# EAGLE design Audio (EAGLE 9.7.0)

## Sheet 1 of 2: ESP32
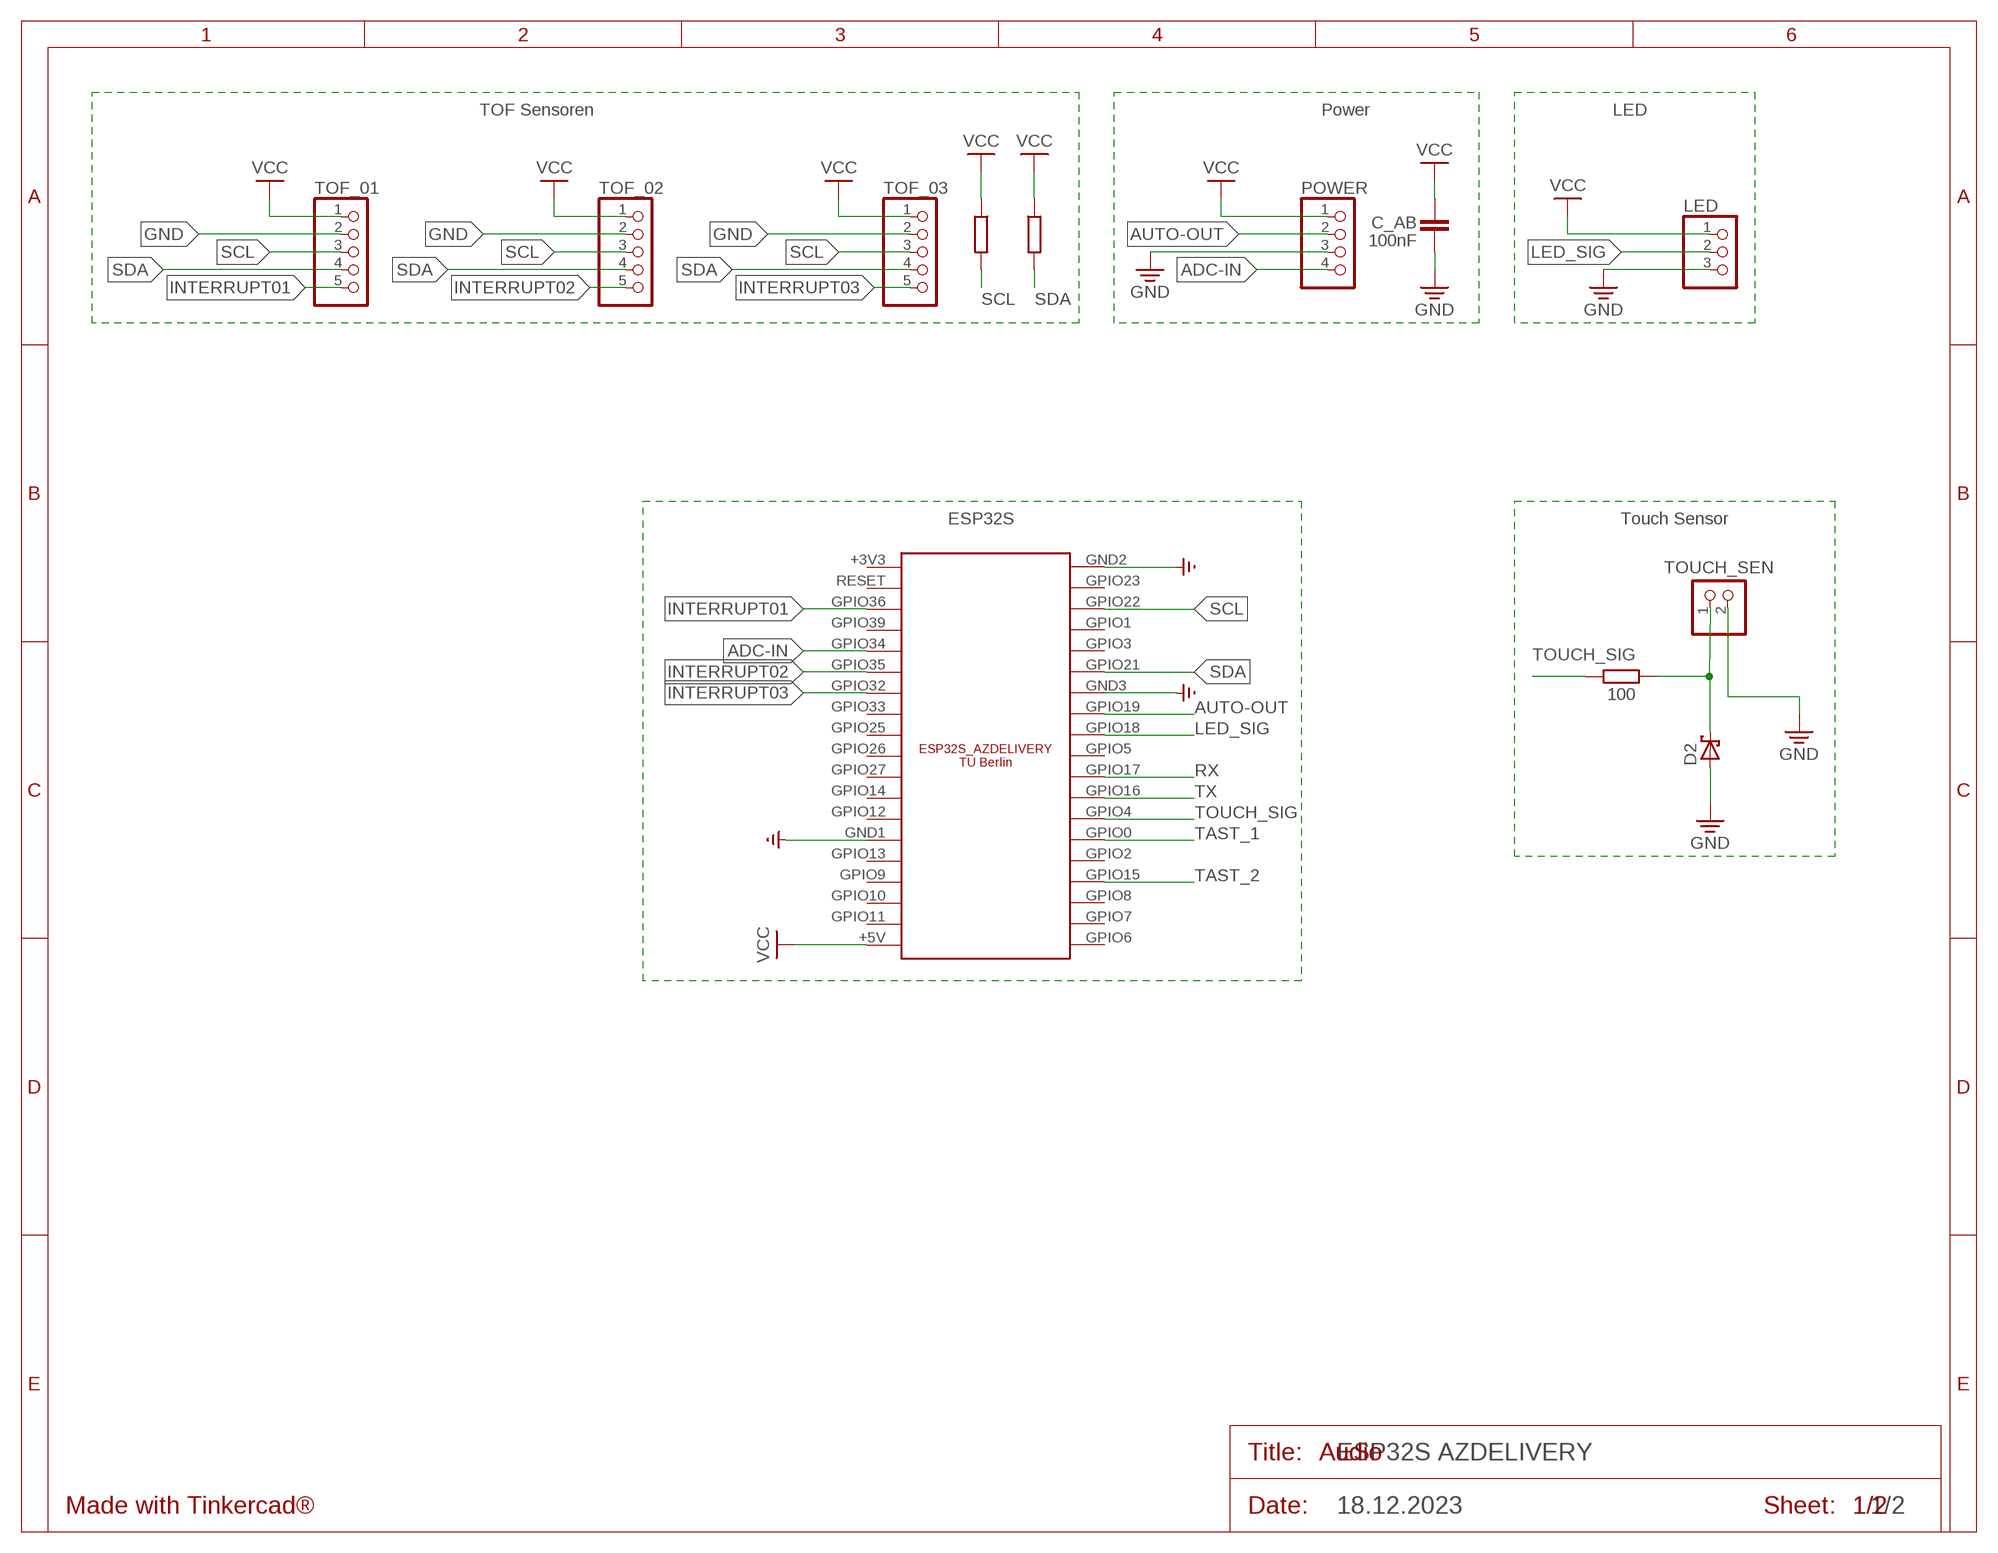
[diagram p0: schematic, sheet 1]

### Parts
C_AB  100nF  C-EUC1206K  [C1206K]
D2  1PS79SB30  [SOD523]
LED  PINHD-1X3/90  [1X03/90]
POWER  PINHD-1X4/90  [1X04/90]
R_FIL_6  100  R-EU_R1206  [R1206]
R_FIL_7  100  R-EU_R1206  [R1206]
R_TOUCH  100  R-EU_R1206  [R1206]
TOF_01  PINHD-1X5/90  [1X05/90]
TOF_02  PINHD-1X5/90  [1X05/90]
TOF_03  PINHD-1X5/90  [1X05/90]
TOUCH_SEN  PINHD-1X2/90  [1X02/90]
U$1  ESP32S_AZDELIVERY  [ESP32S_AZDELIVERY]

### Nets
ADC-IN: POWER.4 U$1.GPIO34
AUTO-OUT: POWER.2 U$1.GPIO19
GND: C_AB.1 D2.2(A) LED.3 POWER.3 TOF_01.2 TOF_02.2 TOF_03.2 TOUCH_SEN.2 U$1.GND1 U$1.GND2 U$1.GND3 ; supply symbol labelled SUPPLY0_GND_ ; also sheet 2
INTERRUPT01: TOF_01.5 U$1.GPIO36
INTERRUPT02: TOF_02.5 U$1.GPIO35
INTERRUPT03: TOF_03.5 U$1.GPIO32
LED_SIG: LED.2 U$1.GPIO18
N$10: D2.1(K) R_TOUCH.1 TOUCH_SEN.1
RX: U$1.GPIO17 ; also sheet 2
SCL: R_FIL_6.2 TOF_01.3 TOF_02.3 TOF_03.3 U$1.GPIO22
SDA: R_FIL_7.2 TOF_01.4 TOF_02.4 TOF_03.4 U$1.GPIO21
TAST_1: U$1.GPIO0 ; also sheet 2
TAST_2: U$1.GPIO15 ; also sheet 2
TOUCH_SIG: R_TOUCH.2 U$1.GPIO4
TX: U$1.GPIO16 ; also sheet 2
VCC: C_AB.2 LED.1 POWER.1 R_FIL_6.1 R_FIL_7.1 TOF_01.1 TOF_02.1 TOF_03.1 U$1.+5V ; also sheet 2
Unconnected: U$1.+3V3 U$1.GPIO1 U$1.GPIO2 U$1.GPIO3 U$1.GPIO5 U$1.GPIO6 U$1.GPIO7 U$1.GPIO8 U$1.GPIO9 U$1.GPIO10 U$1.GPIO11 U$1.GPIO12 U$1.GPIO13 U$1.GPIO14 U$1.GPIO23 U$1.GPIO25 U$1.GPIO26 U$1.GPIO27 U$1.GPIO33 U$1.GPIO39 U$1.RESET

### Notes on the sheet
- TOF Sensoren | Power | LED
- ESP32S | Touch Sensor
- ESP32S AZDELIVERY
- 18.12.2023 | 1/2

## Sheet 2 of 2: Audio Gruppe
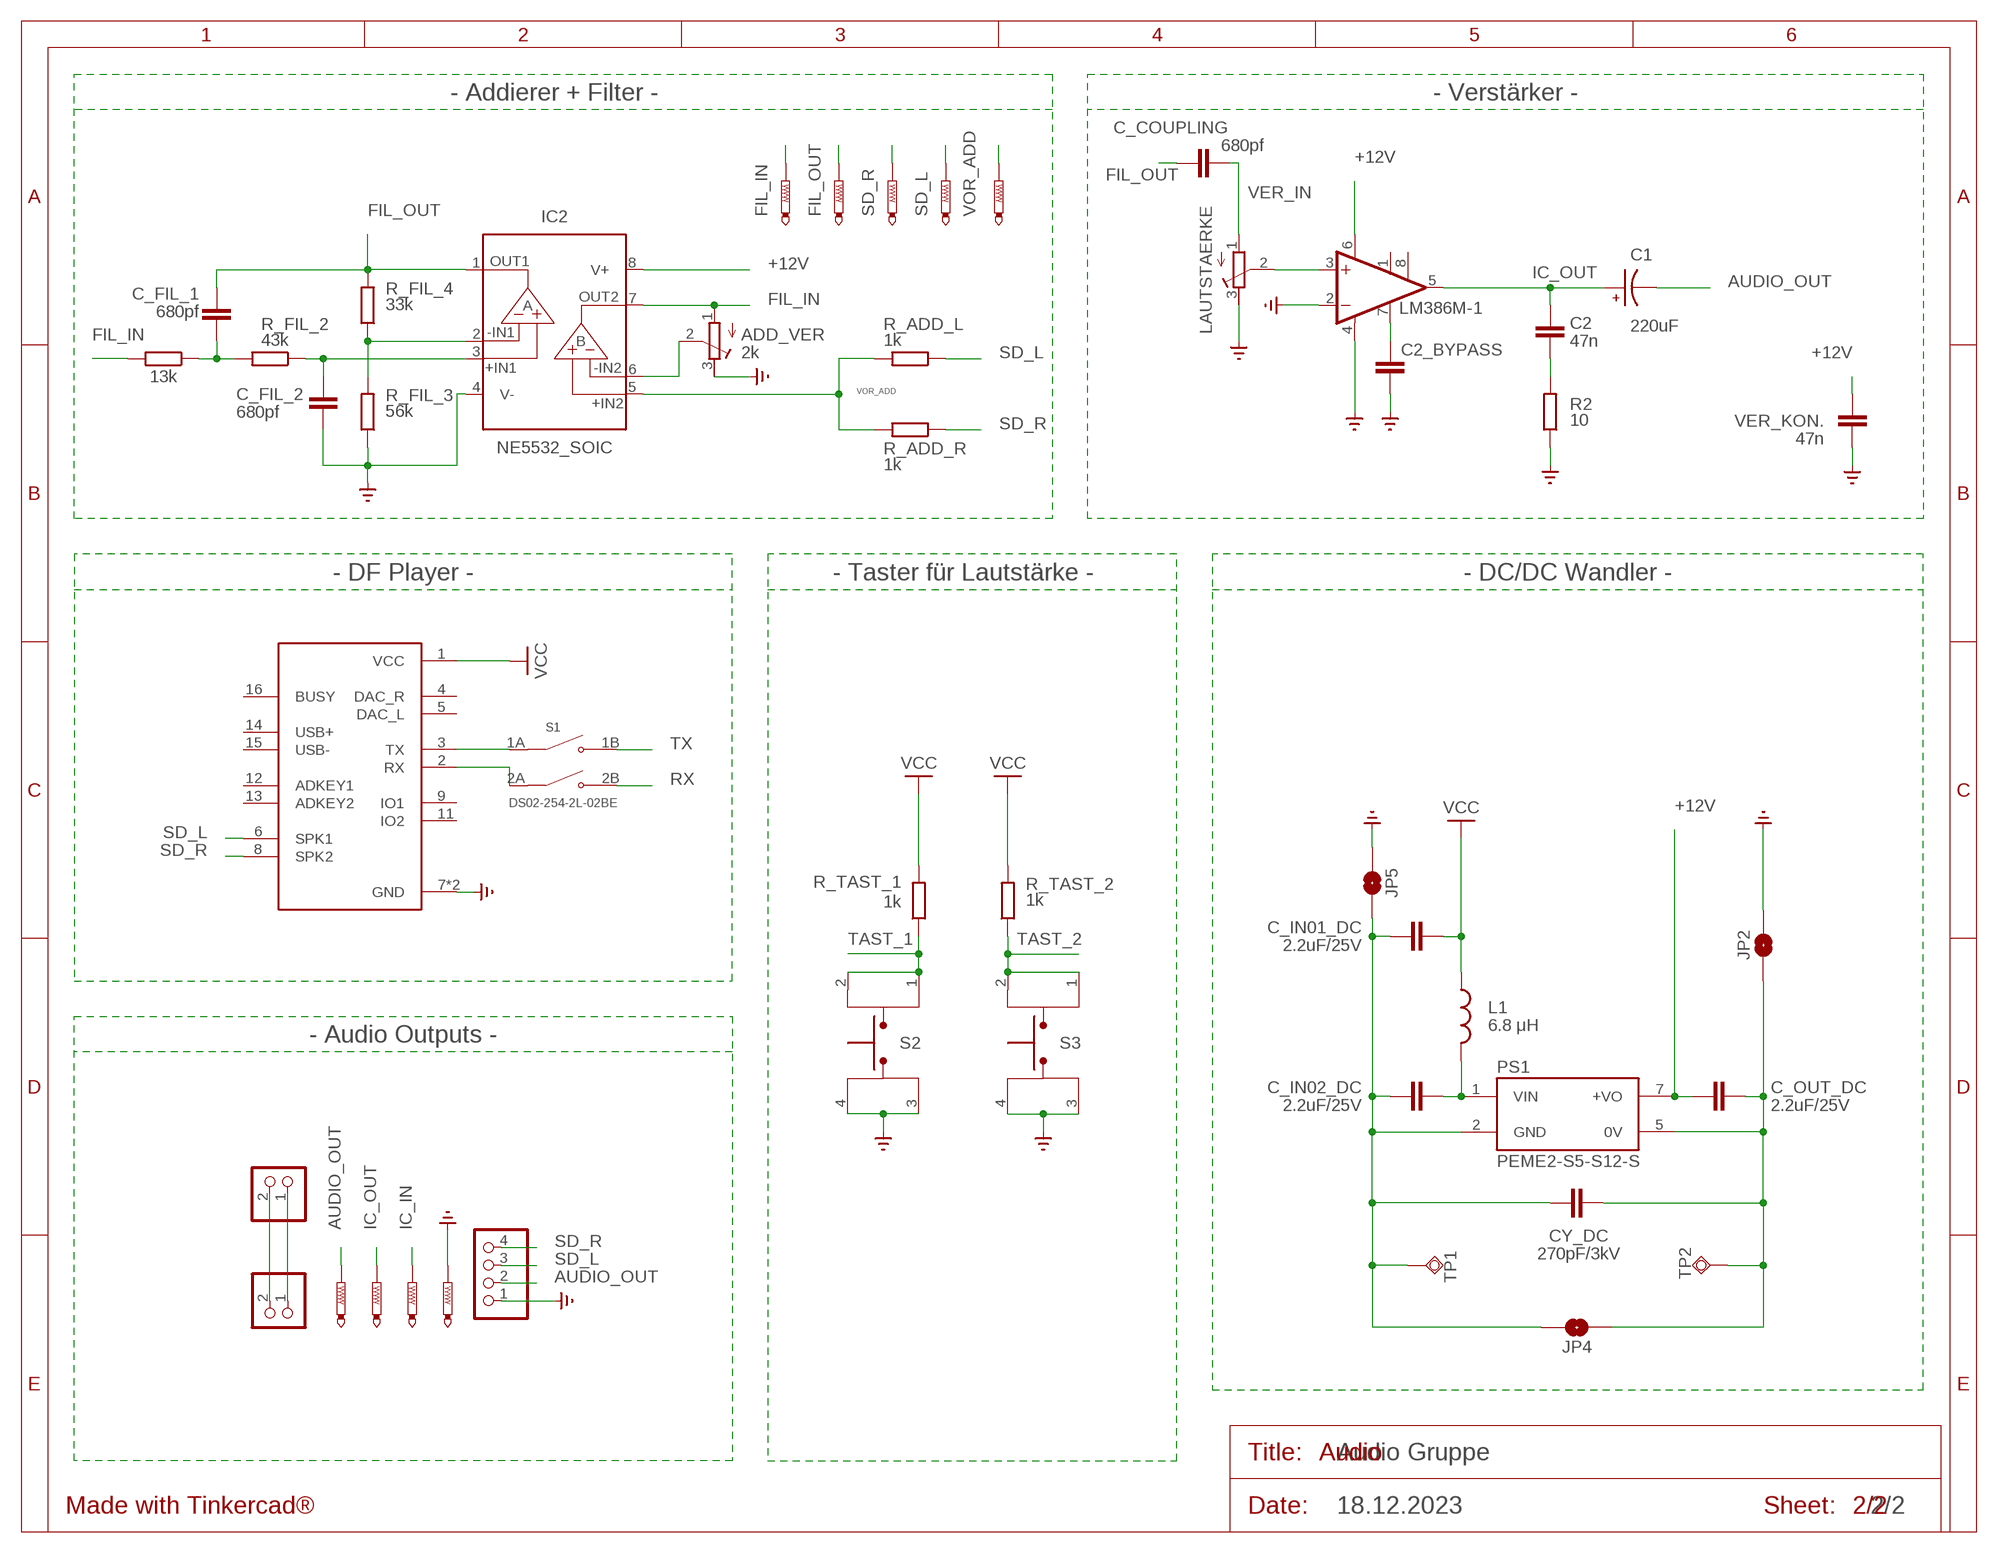
[diagram p1: schematic, sheet 2]

### Parts
ADD_OUT->FIL_IN  PTR1TP10R  [TP10R]
ADD_VER  2k  R-TRIMM4G/J  [RTRIM4G/J]
AUDIO_OUT1  PTR1TP10R  [TP10R]
C1  220uF  EEEFTE221XAP  [CAP_EEEFTE221XAP]
C2  47n  C-EUC1206K  [C1206K]
C2_BYPASS  C-EUC1206K  [C1206K]
C_COUPLING  680pf  C-EUC1206K  [C1206K]
C_FIL_1  680pf  C-EUC1206K  [C1206K]
C_FIL_2  680pf  C-EUC1206K  [C1206K]
C_IN01_DC  2.2uF/25V  C-EUC1206K  [C1206K]
C_IN02_DC  2.2uF/25V  C-EUC1206K  [C1206K]
C_OUT_DC  2.2uF/25V  C-EUC1206K  [C1206K]
CY_DC  270pF/3kV  C-EUC1206K  [C1206K]
FIL_OUT->AUDIO_IN  PTR1TP10R  [TP10R]
GND  PTR1TP10R  [TP10R]
IC1  LM386M-1  [SO08]
IC2  NE5532_SOIC  [SOIC127P600X175-8N]
IC_IN  PTR1TP10R  [TP10R]
IC_OUT  PTR1TP10R  [TP10R]
JP1  PINHD-1X2  [1X02]
JP2  JUMPER-SMT_2_NO_SILK  [SMT-JUMPER_2_NO_SILK]
JP3  PINHD-1X4  [1X04]
JP4  JUMPER-SMT_2_NO_SILK  [SMT-JUMPER_2_NO_SILK]
JP5  JUMPER-SMT_2_NO_SILK  [SMT-JUMPER_2_NO_SILK]
JP6  PINHD-1X2  [1X02]
L1  6.8 μH  L_CHIP-1206(3216-METRIC)  [INDC3216X190]
LAUTSTAERKE  R-TRIMM4G/J  [RTRIM4G/J]
PS1  PEME2-S5-S12-S  [CONV_PEME2-S5-S12-S]
R2  10  R-EU_R1206  [R1206]
R_ADD_L  1k  R-EU_R1206  [R1206]
R_ADD_R  1k  R-EU_R1206  [R1206]
R_FIL_1  13k  R-EU_R1206  [R1206]
R_FIL_2  43k  R-EU_R1206  [R1206]
R_FIL_3  56k  R-EU_R1206  [R1206]
R_FIL_4  33k  R-EU_R1206  [R1206]
R_TAST_1  1k  R-EU_R1206  [R1206]
R_TAST_2  1k  R-EU_R1206  [R1206]
S1  DS02-254-2L-02BE  [SW_DS02-254-2L-02BE]
S2  TL3305AF160QG  [SW_TL3305AF160QG]
S3  TL3305AF160QG  [SW_TL3305AF160QG]
SD_L  PTR1TP10R  [TP10R]
SD_R  PTR1TP10R  [TP10R]
TP1  TPSQPAD1-20Y  [P1-20Y]
TP2  TPSQPAD1-20Y  [P1-20Y]
U1  DFR0299  [MODULE_DFR0299]
VER_KON.  47n  C-EUC1206K  [C1206K]
VOR_ADD  PTR1TP10R  [TP10R]

### Nets
+12V: C_OUT_DC.1 IC1.6(VS) IC2.8(V+) PS1.7(+VO) VER_KON..2
AUDIO_OUT: AUDIO_OUT1.TP C1.2 JP3.2
FIL_IN: ADD_OUT->FIL_IN.TP ADD_VER.1(A) IC2.7(OUT2) R_FIL_1.2
FIL_OUT: C_COUPLING.2 C_FIL_1.2 FIL_OUT->AUDIO_IN.TP IC2.1(OUT1) R_FIL_4.2
GND: ADD_VER.3(E) C2_BYPASS.1 C_FIL_2.1 GND.TP IC1.2(-IN) IC1.4(GND) IC2.4(V-) JP2.2 JP3.1 JP5.1 LAUTSTAERKE.3(E) R2.1 R_FIL_3.1 S2.3 S2.4 S3.3 S3.4 U1.7(GND) U1.10(GND) VER_KON..1 ; supply symbol labelled SUPPLY0_GND_ ; also sheet 1
IC_IN: IC1.3(+IN) IC_IN.TP LAUTSTAERKE.2(S)
IC_OUT: C1.1 C2.2 IC1.5(OUT) IC_OUT.TP
N$1: IC2.2(-IN1) R_FIL_3.2 R_FIL_4.1
N$2: C2_BYPASS.2 IC1.7(BYPASS)
N$3: C2.1 R2.2
N$4: C_FIL_1.1 R_FIL_1.1 R_FIL_2.2
N$5: C_FIL_2.2 IC2.3(+IN1) R_FIL_2.1
N$6: S1.1A(COM1) U1.3(TX)
N$7: S1.2A(COM2) U1.2(RX)
N$8: JP1.2 JP6.2
N$9: JP1.1 JP6.1
N$13: ADD_VER.2(S) IC2.6(-IN2)
N$22: C_IN02_DC.2 L1.2 PS1.1(VIN)
N$29: C_OUT_DC.2 CY_DC.2 JP2.1 JP4.1 PS1.5(0V) TP2.TP
N$30: C_IN01_DC.1 C_IN02_DC.1 CY_DC.1 JP4.2 JP5.2 PS1.2(GND) TP1.TP
RX: S1.2B(NO2) ; also sheet 1
SD_L: JP3.3 R_ADD_L.1 SD_L.TP U1.6(SPK1)
SD_R: JP3.4 R_ADD_R.1 SD_R.TP U1.8(SPK2)
TAST_1: R_TAST_1.1 S2.1 S2.2 ; also sheet 1
TAST_2: R_TAST_2.1 S3.1 S3.2 ; also sheet 1
TX: S1.1B(NO1) ; also sheet 1
VCC: C_IN01_DC.2 L1.1 R_TAST_1.2 R_TAST_2.2 U1.1(VCC) ; also sheet 1
VER_IN: C_COUPLING.1 LAUTSTAERKE.1(A)
VOR_ADD: IC2.5(+IN2) R_ADD_L.2 R_ADD_R.2 VOR_ADD.TP
Unconnected: IC1.1(GAIN) IC1.8(GAIN) U1.4(DAC_R) U1.5(DAC_L) U1.9(IO1) U1.11(IO2) U1.12(ADKEY1) U1.13(ADKEY2) U1.14(USB+) U1.15(USB-) U1.16(BUSY)

### Notes on the sheet
- - Addierer + Filter - | - Verstärker -
- - DF Player - | - Taster für Lautstärke - | - DC/DC Wandler -
- - Audio Outputs -
- Audio Gruppe
- 18.12.2023 | 2/2

## Library data of the parts
ADD_OUT->FIL_IN AUDIO_OUT1 FIL_OUT->AUDIO_IN GND IC_IN IC_OUT SD_L SD_R VOR_ADD = testpad:PTR1: TEST PIN
ADD_VER LAUTSTAERKE = rcl:R-TRIMM: Trimm resistor; SPICEMODEL: X; SPICEPREFIXL: POT
C1 = EEEFTE221XAP:EEEFTE221XAP: Check availability <https://pricing.snapeda.com/parts/EEEFTE221XAP/Panasonic/view-part?ref=eda>; AVAILABILITY: In Stock; CHECK_PRICES: https://www.snapeda.com/parts/EEEFTE221XAP/Panasonic/view-part/?ref=eda; DESCRIPTION: 220µF 25V Aluminum Electrolytic Capacitors Radial, Can - SMD 160 mohm @ 100kHz 2000 Hrs @ 105°C; MF: Panasonic; MP: EEEFTE221XAP; PACKAGE: RADIAL-2 Panasonic; PRICE: None; PURCHASE-URL: https://www.snapeda.com/api/url_track_click_mouser/?unipart_id=4221972&manufacturer=Panasonic&part_name=EEEFTE221XAP&search_term=None; SNAPEDA_LINK: https://www.snapeda.com/parts/EEEFTE221XAP/Panasonic/view-part/?ref=snap
C2 C2_BYPASS C_AB C_COUPLING C_FIL_1 C_FIL_2 C_IN01_DC C_IN02_DC C_OUT_DC CY_DC VER_KON. = rcl:C-EU: CAPACITOR, European symbol; SPICEPREFIX: C
D2 = 1PS79SB30:1PS79SB30: Schottky barrier diode Planar Schottky barrier diode encapsulated in a SC-79 ultra small plastic SMD package. AAL Eindhoven MK Check availability <https://pricing.snapeda.com/parts/1PS79SB30/Nexperia%20USA/view-part?ref=eda>; AVAILABILITY: In Stock; CHECK_PRICES: https://www.snapeda.com/parts/1PS79SB30/Nexperia/view-part/?ref=eda; DESCRIPTION: Diode Schottky 40 V 200mA (DC) Surface Mount SOD-523; MF: Nexperia USA; MP: 1PS79SB30; PACKAGE: SOD-523 NXP Semiconductors; PRICE: None; SNAPEDA_LINK: https://www.snapeda.com/parts/1PS79SB30/Nexperia/view-part/?ref=snap
IC1 = linear:LM386?-*: Low Voltage Audio Power Amplifier Source: http://cache.national.com/ds/LM/LM386.pdf
IC2 = IC_Linear:NE5532: Dual Operational Amplifier Reference Datasheet <https://www.ti.com/lit/ds/symlink/ne5532.pdf?ts=1645701697800&ref_url=https%253A%252F%252Fwww.google.com%252F>; CATEGORY: Amplifier; DESCRIPTION: Dual Operational Amplifier; MANUFACTURER: Generic; MPN: Generic; SERIES: NE5532; SUB-CATEGORY: OpAmp; TYPE: Dual
JP1 JP6 = Connector:PINHD-1X2: PIN HEADER; CATEGORY: CONNECTOR; SUB-CATEGORY: PIN-HEADER
JP2 JP4 JP5 = SparkFun-Jumpers:JUMPER-SMT_2_NO: Normally open jumper This jumper has two pads in close proximity to each other. Apply solder to close the connection. Round pads are easier to solder for beginners, but are a lot larger. SparkFun Product that uses the round pads: SparkFun EL Sequencer <https://www.sparkfun.com/products/12781>
JP3 = Connector:PINHD-1X4: PIN HEADER; CATEGORY: CONNECTOR; SUB-CATEGORY: PIN-HEADER
L1 = Inductor:L: Inductor Fixed - Generic; CATEGORY: Inductor; SUB-CATEGORY: Fixed
LED = Connector:PINHD-1X3: PIN HEADER; CATEGORY: Headers; DESCRIPTION: Header, Right Angle, 3 Position; MANUFACTURER: Generic; MPN: Generic; OPERATING_TEMPERATURE: Generic; PART_STATUS: Active; PITCH: 0.100" (2.54mm); ROHS_COMPLIANCE: Generic; SERIES: Generic; SUB-CATEGORY: Headers, Male Pins; TYPE: Board to Board or Cable, Unshrouded, Through Hole, Right Angle
POWER = Connector:PINHD-1X4: PIN HEADER; CATEGORY: Headers; DESCRIPTION: Header, Right Angle, 4 Position; MANUFACTURER: Generic; MPN: Generic; OPERATING_TEMPERATURE: Generic; PART_STATUS: Active; PITCH: 0.100" (2.54mm); ROHS_COMPLIANCE: Generic; SERIES: Generic; SUB-CATEGORY: Headers, Male Pins; TYPE: Board to Board or Cable, Unshrouded, Through Hole, Right Angle
PS1 = PEME2-S5-S12-S:PEME2-S5-S12-S: Check availability <https://pricing.snapeda.com/parts/PEME2-S5-S12-S/CUI/view-part?ref=eda> Check availability <https://pricing.snapeda.com/parts/PEME2-S5-S12-S/CUI/view-part?ref=eda> Check availability <https://pricing.snapeda.com/parts/PEME2-S5-S12-S/CUI%20Inc./view-part?ref=eda>; AVAILABILITY: In Stock; CHECK_PRICES: https://www.snapeda.com/parts/PEME2-S5-S12-S/CUI/view-part/?ref=eda; CUI_PURCHASE_URL: https://www.cui.com/product/dc-dc-converters/isolated/peme2-s-series?utm_source=snapeda.com&utm_medium=referral&utm_campaign=snapedaBOM; DESCRIPTION: 2 W, 1:1 Input Range, Single/Dual Unregulated Output, SIP, 3000 Vdc Isolation, Dc-Dc Converter; MF: CUI Inc.; MP: PEME2-S5-S12-S; PACKAGE: None; PRICE: None; PURCHASE-URL: https://www.snapeda.com/api/url_track_click_mouser/?unipart_id=11882107&manufacturer=CUI Inc.&part_name=PEME2-S5-S12-S&search_term=peme2-s5-s12-s; SNAPEDA_LINK: https://www.snapeda.com/parts/PEME2-S5-S12-S/CUI/view-part/?ref=snap
R2 R_ADD_L R_ADD_R R_FIL_1-R_FIL_4 R_FIL_6 R_FIL_7 R_TAST_1 R_TAST_2 R_TOUCH = rcl:R-EU_: RESISTOR, European symbol; SPICEPREFIX: R
S1 = DS02:DS02-254-2L-02BE: Check availability <https://pricing.snapeda.com/parts/DS02-254-2L-02BE/CUI%20Devices/view-part?ref=eda>; AVAILABILITY: In Stock; CHECK_PRICES: https://www.snapeda.com/parts/DS02-254-2L-02BE/CUI+Devices/view-part/?ref=eda; CUI_PURCHASE_URL: https://www.cuidevices.com/product/switches/dip-switches/ds02-254-2l-02be?utm_source=snapeda.com&utm_medium=referral&utm_campaign=snapedaBOM; DESCRIPTION: 2 Position, Through Hole, 2.54 mm Pitch, Flat Piano Slide Actuator, Flat Bottom, Long Pin, DIP Switch; MF: CUI Devices; MP: DS02-254-2L-02BE; PACKAGE: None; PRICE: None; PURCHASE-URL: https://www.snapeda.com/api/url_track_click_mouser/?unipart_id=4467380&manufacturer=CUI Devices&part_name=DS02-254-2L-02BE&search_term=nt 02 dip switch; SNAPEDA_LINK: https://www.snapeda.com/parts/DS02-254-2L-02BE/CUI+Devices/view-part/?ref=snap
S2 S3 = TL3305AF160QG:TL3305AF160QG: Check availability <https://pricing.snapeda.com/parts/TL3305AF160QG/E-Switch/view-part?ref=eda>; AVAILABILITY: In Stock; CHECK_PRICES: https://www.snapeda.com/parts/TL3305AF160QG/E-Switch/view-part/?ref=eda; DESCRIPTION: Tactile Switch SPST-NO Top Actuated Surface Mount; MF: E-Switch; MP: TL3305AF160QG; PACKAGE: None; PRICE: None; PURCHASE-URL: https://www.snapeda.com/api/url_track_click_mouser/?unipart_id=560109&manufacturer=E-Switch&part_name=TL3305AF160QG&search_term=switch smd; SNAPEDA_LINK: https://www.snapeda.com/parts/TL3305AF160QG/E-Switch/view-part/?ref=snap
TOF_01-TOF_03 = Connector:PINHD-1X5: PIN HEADER; CATEGORY: Headers; DESCRIPTION: Header, Right Angle, 5 Position; MANUFACTURER: Generic; MPN: Generic; OPERATING_TEMPERATURE: Generic; PART_STATUS: Active; PITCH: 0.100" (2.54mm); ROHS_COMPLIANCE: Generic; SERIES: Generic; SUB-CATEGORY: Headers, Male Pins; TYPE: Board to Board or Cable, Unshrouded, Through Hole, Right Angle
TOUCH_SEN = Connector:PINHD-1X2: PIN HEADER; CATEGORY: Headers; DESCRIPTION: Header, Right Angle, 2 Position; MANUFACTURER: Generic; MPN: Generic; OPERATING_TEMPERATURE: Generic; PART_STATUS: Active; PITCH: 0.100" (2.54mm); ROHS_COMPLIANCE: Generic; SERIES: Generic; SUB-CATEGORY: Headers, Male Pins; TYPE: Board to Board or Cable, Unshrouded, Through Hole, Right Angle
TP1 TP2 = testpad:TPSQ: Test pad
U1 = DFR0299:DFR0299: Dfplayer - a Mini Mp3 Player Check availability <https://pricing.snapeda.com/parts/DFR0299/DFRobot/view-part?ref=eda>; AVAILABILITY: In Stock; CHECK_PRICES: https://www.snapeda.com/parts/DFR0299/DFRobot/view-part/?ref=eda; DESCRIPTION: - MP3 Player Audio Arduino Platform Evaluation Expansion Board; MF: DFRobot; MP: DFR0299; PACKAGE: None; PRICE: None; PURCHASE-URL: https://www.snapeda.com/api/url_track_click_mouser/?unipart_id=588059&manufacturer=DFRobot&part_name=DFR0299&search_term=None; SNAPEDA_LINK: https://www.snapeda.com/parts/DFR0299/DFRobot/view-part/?ref=snap
U$1 = ESP32S_AZDELIVERY:ESP32S_AZDELIVERY: ESP32S_AZDELIVERY erstellet von Ammar Al Dakkak

## Board
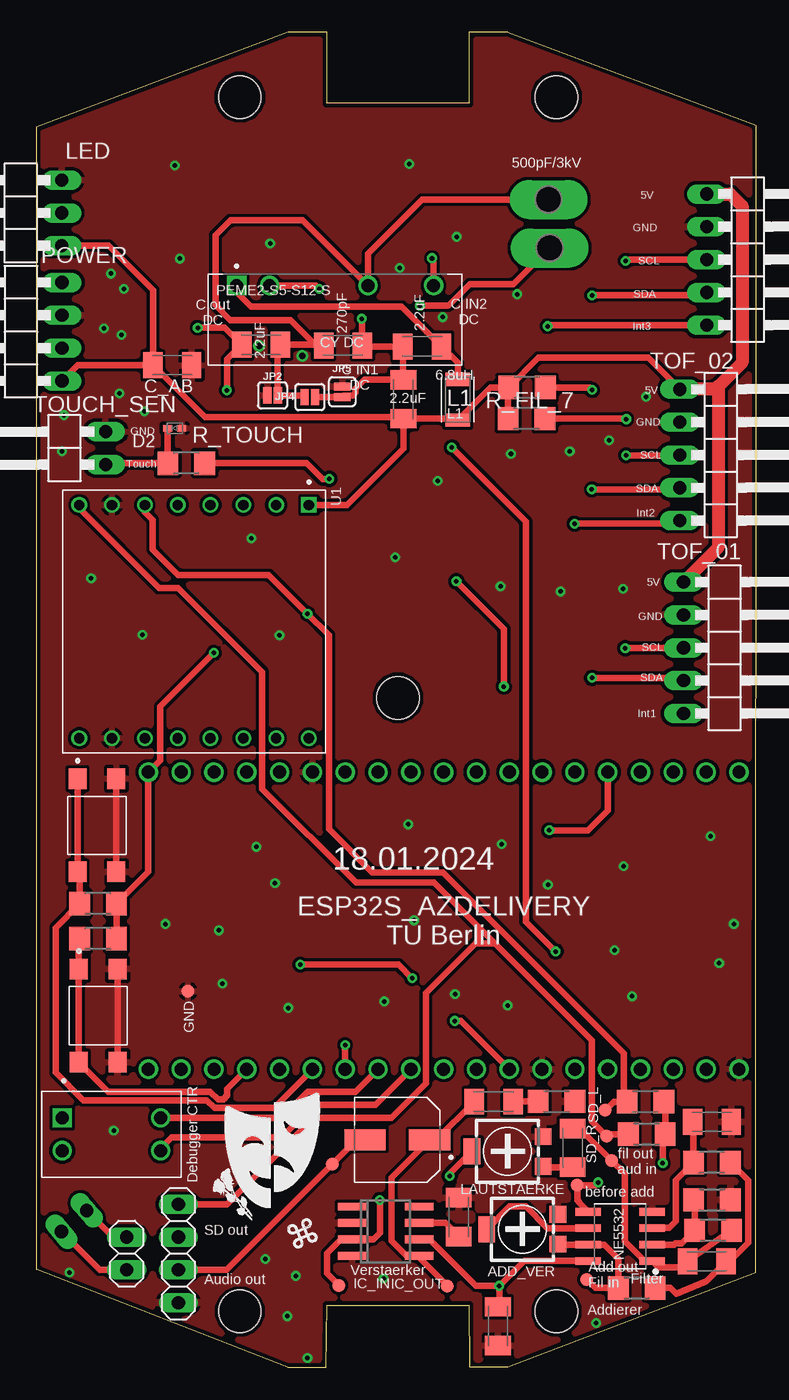
[diagram p2: board, top side]
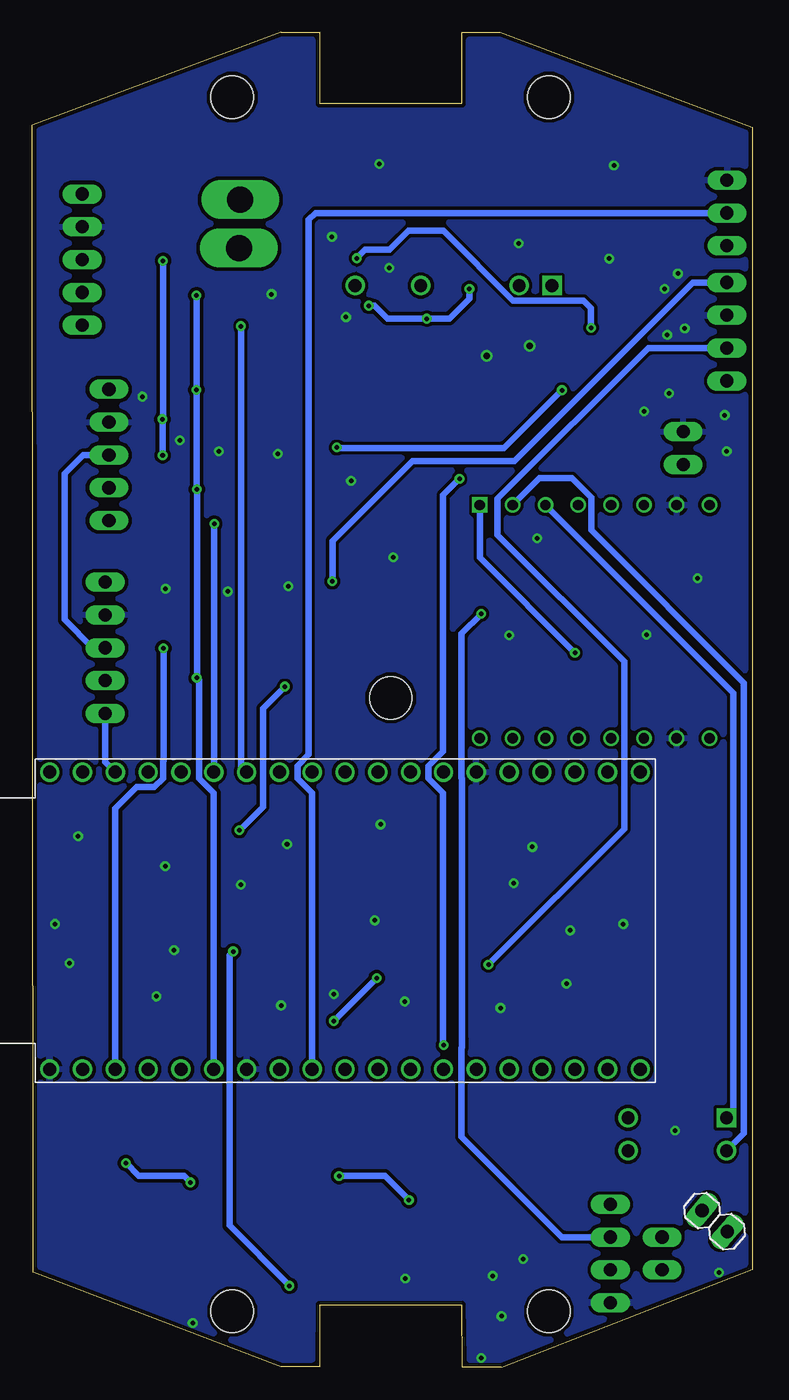
[diagram p3: board, bottom side, seen from below]

Size 55.75 x 103.3 mm. Coordinates in mm from the lower left corner, seen from the top.
Outline: 0,7.53 0,95.94 19.5,103.3 22.5,103.3 22.5,97.8 33.5,97.8 33.5,103.3 36.5,103.3 55.75,96.11 55.69,7.36 36.52,0.01 33.52,0.01 33.5,4.8 22.5,4.8 22.44,0 19.44,0 0,7.57
Copper layers (1*16): Top / Bottom
Stack-up Default Layer Stack: Top User Defined 0.035mm / Dielectric-1 User Defined 1.5mm / Bottom User Defined 0.035mm
Design rules: minimum copper width 0.2mm, minimum drill size 0.3mm, copper clearance wire_polygon to wire_polygon 0.15mm, copper clearance wire_polygon to pad_smd 0.15mm, copper clearance wire_polygon to via 0.15mm, copper clearance pad_smd to pad_smd 0.15mm, copper clearance pad_smd to via 0.15mm, copper clearance via to via 0.15mm, copper clearance smd to pad (same net) 0mil, copper clearance smd to via (same net) 0mil, copper clearance smd to smd (same net) 0mil, dimension clearance 0.3mm, restrict clearance 0mil, drill distance 0.3mm, keepout clearance 0mil
Holes 3.3 mm at 40.27,98.28 15.76,98.28 15.76,4.31 40.27,4.31 28,51.8

### Footprints (pad centres in the part's own frame; a part is rotated, then mirrored left to right if it is on the bottom)
TP10R = smd 1 x 1: TP 0,0
RTRIM4G/J = smd 1.3 x 1.3: 1 -1.15,-2.75; 3 1.15,-2.75 | smd 2 x 1.3: 2 0,2.75
CAP_EEEFTE221XAP = smd 3.2 x 1.6: 1 -2.5,0; 2 2.5,0
C1206K = smd 1.5 x 2: 1 -1.5,0; 2 1.5,0
SOD523 = smd 0.7 x 0.5: 1 0.55,0; 2 -0.55,0
SO08 = smd 0.6 x 2.2: 1 -1.905,-2.6; 2 -0.635,-2.6; 3 0.635,-2.6; 4 1.905,-2.6; 5 1.905,2.6; 6 0.635,2.6; 7 -0.635,2.6; 8 -1.905,2.6
SOIC127P600X175-8N = smd 1.969 x 0.592: 1 -2.474,1.905; 2 -2.474,0.635; 3 -2.474,-0.635; 4 -2.474,-1.905; 5 2.474,-1.905; 6 2.474,-0.635; 7 2.474,0.635; 8 2.474,1.905
1X02 = drill 1.016 long: 1 -1.27,0; 2 1.27,0
SMT-JUMPER_2_NO_SILK = smd 0.635 x 1.27: 1 -0.406,0; 2 0.406,0
1X04 = drill 1.016 long: 1 -3.81,0; 2 -1.27,0; 3 1.27,0; 4 3.81,0
INDC3216X190 = smd 1.043 x 1.91: 1 -1.584,0; 2 1.584,0
1X03/90 = drill 1.016 long: 1 -2.54,-3.81; 2 0,-3.81; 3 2.54,-3.81
1X04/90 = drill 1.016 long: 1 -3.81,-3.81; 2 -1.27,-3.81; 3 1.27,-3.81; 4 3.81,-3.81
CONV_PEME2-S5-S12-S = drill 1 square: 1 -7.615,2.625 | drill 1: 2 -5.075,2.625; 5 2.545,2.625; 7 7.625,2.625
R1206 = smd 1.6 x 1.803: 1 -1.422,0; 2 1.422,0
SW_DS02-254-2L-02BE = drill 1 square: 1A -1.27,-3.81 | drill 1: 1B -1.27,3.81; 2A 1.27,-3.81; 2B 1.27,3.81
SW_TL3305AF160QG = smd 1.6 x 1.4: 1 -3.6,-1.5; 2 3.6,-1.5; 3 -3.6,1.5; 4 3.6,1.5
1X05/90 = drill 1.016 long: 1 -5.08,-3.81; 2 -2.54,-3.81; 3 0,-3.81; 4 2.54,-3.81; 5 5.08,-3.81
1X02/90 = drill 1.016 long: 1 -1.27,-3.81; 2 1.27,-3.81
P1-20Y = drill 2.007 pad 2.54 long: TP 0,0
MODULE_DFR0299 = drill 0.8 square: 1 -9.017,8.89 | drill 0.8: 2 -9.017,6.35; 3 -9.017,3.81; 4 -9.017,1.27; 5 -9.017,-1.27; 6 -9.017,-3.81; 7 -9.017,-6.35; 8 -9.017,-8.89; 9 9.017,-8.89; 10 9.017,-6.35; 11 9.017,-3.81; 12 9.017,-1.27; 13 9.017,1.27; 14 9.017,3.81; 15 9.017,6.35; 16 9.017,8.89
ESP32S_AZDELIVERY = drill 1: +3V3 -11.5,22.86; +5V -11.5,-22.86; GND1 -11.5,-10.16; GND2 11.5,22.86; GND3 11.5,7.62; GPIO0 11.5,-10.16; GPIO1 11.5,15.24; GPIO2 11.5,-12.7; GPIO3 11.5,12.7; GPIO4 11.5,-7.62; GPIO5 11.5,0; GPIO6 11.5,-22.86; GPIO7 11.5,-20.32; GPIO8 11.5,-17.78; GPIO9 -11.5,-15.24; GPIO10 -11.5,-17.78; GPIO11 -11.5,-20.32; GPIO12 -11.5,-7.62; GPIO13 -11.5,-12.7; GPIO14 -11.5,-5.08; GPIO15 11.5,-15.24; GPIO16 11.5,-5.08; GPIO17 11.5,-2.54; GPIO18 11.5,2.54; GPIO19 11.5,5.08; GPIO21 11.5,10.16; GPIO22 11.5,17.78; GPIO23 11.5,20.32; GPIO25 -11.5,2.54; GPIO26 -11.5,0; GPIO27 -11.5,-2.54; GPIO32 -11.5,7.62; GPIO33 -11.5,5.08; GPIO34 -11.5,12.7; GPIO35 -11.5,10.16; GPIO36 -11.5,17.78; GPIO39 -11.5,15.24; RESET -11.5,20.32

### Placement (x,y rotation side)
ADD_OUT->FIL_IN  42.61,6.8 180 top
ADD_VER  37.62,10.68 90 top
AUDIO_OUT1  22.9,15.7 0 top
C1  27.95,17.59 180 top
C2  35.41,20.55 180 top
C2_BYPASS  32.71,11.61 270 top
C_AB  10.53,77.54 180 top
C_COUPLING  41.52,16.98 90 top
C_FIL_1  51.9,8.2 180 top
C_FIL_2  52.3,18.98 180 top
C_IN01_DC  28.42,74.9 270 top
C_IN02_DC  29.87,78.99 0 top
C_OUT_DC  17.4,79.13 0 top
CY_DC  23.74,79.07 180 top
D2  10.71,72.66 180 top
FIL_OUT->AUDIO_IN  44.55,15.98 0 top
GND  11.75,29.08 0 top
IC1  27.05,10.53 270 top
IC2  45.2,10.12 180 top
IC_IN  23.43,6.33 0 top
IC_OUT  31.82,6.3 0 top
JP1  7,8.8 90 top
JP2  18.29,75.19 180 top
JP3  11,8.8 90 top
JP4  21.18,75.07 0 top
JP5  23.68,75.48 270 top
JP6  2.93,11.31 140 bottom
L1  32.63,74.87 90 top
LAUTSTAERKE  36.49,16.7 90 top
LED  -1.83,89.32 90 top
POWER  -1.81,80.13 90 top
PS1  23.13,81.08 0 top
R2  40.27,20.57 180 top
R_ADD_L  47.16,20.55 0 top
R_ADD_R  47.26,18.03 0 top
R_FIL_1  46.48,6.14 180 top
R_FIL_2  52.3,15.84 0 top
R_FIL_3  52.3,12.95 180 top
R_FIL_4  52.39,10.59 0 top
R_FIL_6  37.95,73.41 0 top
R_FIL_7  37.99,75.82 0 top
R_TAST_1  4.79,35.87 0 top
R_TAST_2  4.79,33.16 0 top
R_TOUCH  11.61,69.95 0 top
S1  5.82,18.02 270 top
S2  4.7,41.93 270 top
S3  4.8,27.2 270 top
SD_L  44.05,19.88 0 top
SD_R  44.15,17.88 0 top
TOF_01  53.92,55.67 270 top
TOF_02  53.63,70.59 270 top
TOF_03  55.7,85.71 270 top
TOUCH_SEN  1.55,71.13 90 top
TP1  39.75,86.61 270 top
TP2  39.65,90.36 270 top
U1  12.22,57.7 270 top
U$1  31.54,34.55 270 top
VER_KON.  35.74,3.17 90 top
VOR_ADD  41.89,14.08 180 top

### Tracks (layer width: path | path; a pad name or v marks a point on that pad's centre or on a via)
+12V  (via drill 0.35)
  Top 0.508: v14.75,75.61 14.78,75.61 14.78,78 C_OUT_DC.1 14.59,80.44 v12.5,80.44 | v32.17,71.17 37.9,65.44 37.9,34.47 v40.2,32.17 | IC1.6 30.45,9.89 34.05,6.29 v35.84,6.29 | v35.84,6.29 35.84,4.78 VER_KON..2 | IC2.8 37.77,8.22 v35.84,6.29 | v30.63,85.82 30.76,85.69 PS1.7
  Bottom 0.508: v14.75,75.61 19.23,71.12 32.17,71.12 v32.17,71.17 | v40.2,32.17 40.49,31.88 40.49,10.97 v35.83,6.31 v35.84,6.29 | v35.84,6.29 | v30.63,85.82 29.98,86.47 28.11,86.47 26.64,87.93 23.92,87.93 18.54,82.55 13.1,82.55 12.5,81.95 v12.5,80.44
ADC-IN  (via drill 0.35)
  Top 0.508: v32.52,60.81 36.2,57.13 v36.2,52.67 | v39.72,41.54 42.72,41.54 44.24,43.06 U$1.GPIO34
  Bottom 0.508: POWER.4 4.63,83.94 18.44,70.13 26.34,70.13 32.52,63.95 v32.52,60.81 | v36.2,52.67 37.9,50.96 37.9,43.36 v39.72,41.54
AUDIO_OUT
  Top 0.5: AUDIO_OUT1.TP 14.73,7.53 JP3.2
  Top 0.508: C1.2 24.79,17.59 AUDIO_OUT1.TP
AUTO-OUT  (via drill 0.35)
  Top 0.508: v20.44,31.15 28.04,31.15 v29.09,30.1 | v32.4,26.79 32.88,26.79 U$1.GPIO19
  Bottom 0.508: POWER.2 8.08,78.86 19.74,67.21 19.74,64.4 9.92,54.59 9.92,41.67 v20.44,31.15 | v29.09,30.1 v32.4,26.79
FIL_IN
  Top 0.508: ADD_VER.1 40.42,9.49 IC2.7 43.97,9.49 45.06,8.41 R_FIL_1.2 43.28,6.14 ADD_OUT->FIL_IN.TP
FIL_OUT
  Top 0.508: R_FIL_4.2 C_FIL_1.2 49.95,7.75 48.15,7.75 IC2.1 47.08,8.22 45.55,9.75 45.55,14.98 FIL_OUT->AUDIO_IN.TP 42.05,18.48 C_COUPLING.2
GND  (via drill 0.35, 0.5)
  Top 0.508: S2.3 S2.4 | S3.3 S3.4
  other vias: 6,18.3 10,34.3 54,34.3 17.74,8.37 8.21,56.69 18.83,56.65 4.25,61.05 16.66,64.15 26.88,6.86 20.1,7.07 19.43,3.95 14.4,29.69 14.13,33.8 18.49,37.44 17.04,40.26 52.87,31.26 44.78,32.26 45.46,38.77 52.2,41.09 46.13,28.7 36.03,40.48 39.61,37.34 28.79,42 29.25,34.58 36.48,28 32.42,28.86 26.93,28.3 19.51,27.8 18.11,86.96 11.11,85.79 31.47,81.26 32.55,87.48 47.21,75.1 44.33,71.72 41.3,70.87 36.74,70.67 40.6,60.03 45.43,60.23 35.94,60.43 31.07,68.58 27.8,62.67 28.88,93.1 10.73,93 5.24,80.38 6.6,79.87 6.45,75.36 8.38,73.96 2.15,73.67 2,70.87 6.8,83.44 5.78,84.63 43.33,3.42 21,0.71 2.58,7.33 37.23,83.03 20.59,78.27 17.25,79.03 28.13,85.07
  pour Bottom (isolate 0.254): 56.25,103.55 -0.25,103.55 -0.25,-0.96 56.25,-0.96
  pour Top (isolate 0.254): 56.25,103.55 -0.25,103.55 -0.25,-0.96 56.25,-0.96
IC_IN  (via drill 0.35)
  Top 0.508: IC_IN.TP 22.5,7.26 22.5,8.8 23.59,9.89 IC1.3 26.09,9.89 26.59,10.39 v26.59,12.94 | LAUTSTAERKE.2 32,14.96 v32,14.8
  Bottom 0.508: v26.59,12.94 28.45,14.8 v32,14.8
IC_OUT
  Top 0.508: IC_OUT.TP 29.65,8.47 IC1.5 28.68,8.62 27.5,9.8 27.5,14.64 C1.1 30.95,17.59 C2.2
INTERRUPT01
  Bottom 0.508: U$1.GPIO36 50.11,46.84 TOF_01.5
INTERRUPT02  (via drill 0.35)
  Top 0.508: TOF_02.5 49.58,65.27 v41.67,65.27
  Bottom 0.508: v41.67,65.27 41.67,46.08 U$1.GPIO35
INTERRUPT03  (via drill 0.35)
  Top 0.508: TOF_03.5 39.66,80.63 v39.59,80.56
  Bottom 0.508: U$1.GPIO32 39.59,46.49 v39.59,80.56
LED_SIG
  Bottom 0.508: U$1.GPIO18 34.08,44.42 35.23,45.58 35.23,46.53 34.35,47.41 34.35,88.79 33.82,89.32 LED.2
N$1
  Top 0.508: R_FIL_3.2 50.97,12.86 R_FIL_4.1 49.98,9.6 49.49,9.6 49.38,9.49 IC2.2
N$2
  Top 0.508: IC1.7 31.66,11.16 C2_BYPASS.2
N$3
  Top 0.508: C2.1 36.94,20.57 R2.2
N$4
  Top 0.508: R_FIL_1.1 49.08,6.14 49.53,5.68 51.87,6.66 C_FIL_1.1 53.67,8.46 53.96,8.46 55.1,9.61 55.1,14.46 R_FIL_2.2
N$5
  Top 0.508: C_FIL_2.2 50.88,18.91 R_FIL_2.1 49.5,14.46 49.5,11.3 49,10.8 47.71,10.8 IC2.3
N$6
  Bottom 0.508: S1.1A 1.5,19.8 1.5,52.19 U1.3
N$7
  Bottom 0.508: U1.2 16.48,68.8 14,68.8 12.48,67.28 12.48,64.78 0.66,52.96 0.66,18.1 S1.2A
N$8
  Top 0.508: JP1.2 5.96,10.07 JP6.2
N$9
  Top 0.508: JP1.1 4.92,7.53 JP6.1
N$10
  Top 0.508: TOUCH_SEN.1 5.46,69.95 R_TOUCH.1 10.19,72.64 D2.1
N$13
  Top 0.508: ADD_VER.2 36.63,12.44 37.89,12.44 39.58,10.76 IC2.6
N$22
  Top 0.508: L1.2 32.63,77.73 C_IN02_DC.2 28.28,82.08 16.62,82.08 15.52,83.18 PS1.1
N$29
  Top 0.508: 21.59,79.13 C_OUT_DC.2 18.69,78.92 JP2.1 20.66,75.19 JP4.1 | CY_DC.2 21.66,79.06 21.59,79.13 | 21.59,79.13 19.69,81.03 15.02,81.03 13.87,82.18 13.87,87.58 15.04,88.76 20.62,88.76 PS1.5 25.68,86.17 29.86,90.36 TP2.TP
N$30  (via drill 0.35)
  Top 0.508: JP4.2 JP5.2 23.77,75.17 24.48,75.17 24.72,75.4 24.72,75.71 25.42,76.4 C_IN01_DC.1 28.37,76.46 C_IN02_DC.1 25.32,78.99 CY_DC.1 25.21,79.1 v25.21,81.14 | v21.91,83.44 21.65,83.7 PS1.2 | TP1.TP 36.95,83.81 33.58,83.81 31.95,82.18 31.83,82.14 v29.7,82.14
  Bottom 0.508: v21.91,83.44 21.91,82.68 23.46,81.14 v25.21,81.14 28.27,81.14 29.28,82.15 v29.69,82.15 v29.7,82.14
RX
  Top 0.508: U$1.GPIO17 26.24,20.3 21.5,20.3 19,17.8 10.5,17.8 9.63,16.93 S1.2B
SCL  (via drill 0.35)
  Top 0.508: v45.66,70.56 49.79,70.56 TOF_02.3 | v45.6,55.64 50.08,55.64 TOF_01.3 | R_FIL_6.2 45.63,73.41 v45.67,73.36 | TOF_03.3 45.72,85.71 v45.63,85.62
  Bottom 0.508: U$1.GPIO22 49.32,43.23 47.65,44.9 46.3,44.9 45.62,45.58 45.62,46.93 45.6,46.95 v45.6,55.64 | v45.63,85.62 45.63,73.41 v45.67,73.36 45.67,70.58 v45.66,70.56 | TOF_02.3 51.8,70.59 53.25,69.14 53.25,57.85 51.07,55.67 TOF_01.3
SD_L  (via drill 0.35)
  Top 0.5: 31.5,38.3 26,38.3 22.65,41.65 22.65,47.3
  Top 0.508: SD_L.TP 44.71,20.55 45.34,20.55 | 45.34,20.55 R_ADD_L.1 45.5,20.79 | 31.5,38.3 45.5,24.3 45.5,20.79 | 45.5,20.79 45.5,20.71 45.34,20.55 | 22.65,47.3 22.65,56.65 v21,58.3 18,61.3 11,61.3 9.02,63.28 9.02,65.56 8.41,66.17 U1.6
  Bottom 0.5: 22.5,17.8 14.77,10.07 JP3.3 | 22.5,42.3 22.5,45.55 22.53,45.58 22.53,56.77 v21,58.3
  Bottom 0.508: 22.5,17.8 22.53,17.83 22.53,24.71 22.48,24.76 22.48,25.41 22.5,25.43 22.5,42.3
SD_R
  Top 0.5: 21.46,19.3 14.77,12.61 JP3.4
  Top 0.508: R_ADD_R.1 44.3,18.03 SD_R.TP 43,19.03 43,25.3 35.5,32.8 | 35.5,32.8 34.25,34.05 | 34.25,34.05 30.8,37.5 24.74,37.5 17.5,44.74 17.5,53.8 11,60.3 9.5,60.3 3.33,66.47 U1.8 | 21.46,19.3 27.5,19.3 30.15,21.95 30.15,28.95 34,32.8 | 34,32.8 35.5,32.8 | 34,32.8 34.25,33.05 34.25,34.05
SDA  (via drill 0.35)
  Top 0.508: v43.01,67.92 49.69,67.92 TOF_02.4 | v43.02,53.34 49.9,53.34 TOF_01.4 | R_FIL_7.2 42.84,75.82 v43.04,75.62 | TOF_03.4 51.67,82.95 v43.04,82.95
  Bottom 0.508: U$1.GPIO21 41.7,44.42 42.85,45.58 42.85,53.17 v43.02,53.34 43.01,53.35 v43.01,67.92 43.04,67.95 v43.04,75.62 v43.04,82.95
TAST_1
  Top 0.508: S2.1 S2.2 3.37,38.16 R_TAST_1.1 1.5,34 1.5,22.8 3.63,20.66 13.2,20.66 13.8,20.07 18.39,20.07 U$1.GPIO0
TAST_2
  Top 0.508: R_TAST_2.1 3.3,33.09 S3.1 S3.2 5.58,21.32 13.47,21.32 14.07,20.72 14.49,20.72 14.78,21.02 14.78,21.54 U$1.GPIO15
TOUCH_SIG  (via drill 0.35)
  Top 0.508: R_TOUCH.2 20.93,69.95 22.14,68.73 22.66,68.73 v22.68,68.75 | v23.91,24.92 v23.92,24.91 U$1.GPIO4
  Bottom 0.508: v23.91,24.92 23.94,24.95 23.94,44.45 25.07,45.58 25.07,46.53 23.94,47.66 23.94,67.48 v22.68,68.75
TX
  Top 0.508: U$1.GPIO16 24.7,21.3 21,21.3 19,19.3 S1.1B
VCC  (via drill 0.35)
  Top 0.508: POWER.1 3.22,77.54 C_AB.2 | C_IN01_DC.2 32.52,73.4 L1.1 35.16,75.82 R_FIL_7.1 | R_FIL_7.1 36.53,75.77 R_FIL_6.1 | R_FIL_7.1 38.87,78.12 47.37,78.12 TOF_02.1 | C_IN01_DC.2 28.42,71.08 24.06,66.72 U1.1 | C_AB.2 13.05,73.52 28.31,73.52 C_IN01_DC.2 | LED.1 5.59,86.78 9.03,83.34 C_AB.2 | R_TAST_2.2 R_TAST_1.2 8.68,38.34 U$1.+5V 9.59,46.96 9.59,51.11 v13.75,55.28
  Top 1.016: 52.79,75.88 54.65,77.74 54.65,89.85 53.72,90.79 TOF_03.1 | 52.79,75.88 52.58,75.67 TOF_02.1 | 52.79,75.88 52.79,63.43 TOF_01.1
  Bottom 0.508: v13.75,55.28 21.11,62.63 U1.1
VER_IN
  Top 0.508: C_COUPLING.1 39.31,15.48 LAUTSTAERKE.1
VOR_ADD  (via drill 0.35)
  Top 0.508: R_ADD_L.2 48.68,20.45 R_ADD_R.2 48.5,17.85 v48.5,15.8 | v43.5,14.3 43.28,14.08 VOR_ADD.TP 41.89,12.92 41.99,12.82 41.99,12.76 IC2.5
  Bottom 0.508: v43.5,14.3 44,14.8 47.5,14.8 v48.5,15.8

### Text on the board
tNames: 500pF/3kV | 5V | GND | SCL | PEME2-S5-S12-S | SDA | C out / DC | 270pF | 2.2uF | C IN2 / DC | 2.2uF | CY DC | Int3 | C IN1 / DC | 6.8uH | 2.2uF | L1 | 5V | GND | GND | SCL | Touch | SDA | Int2 | 5V | GND | SCL | SDA | Int1 | 18.01.2024 | fil out / aud in | Debugger CTR | before add | SD out | NE5532 | Audio out | Verstaerker | Filter | Add out / Fil in | Addierer